# EAGLE schematic CircularControllerBase (EAGLE 8.0.0)
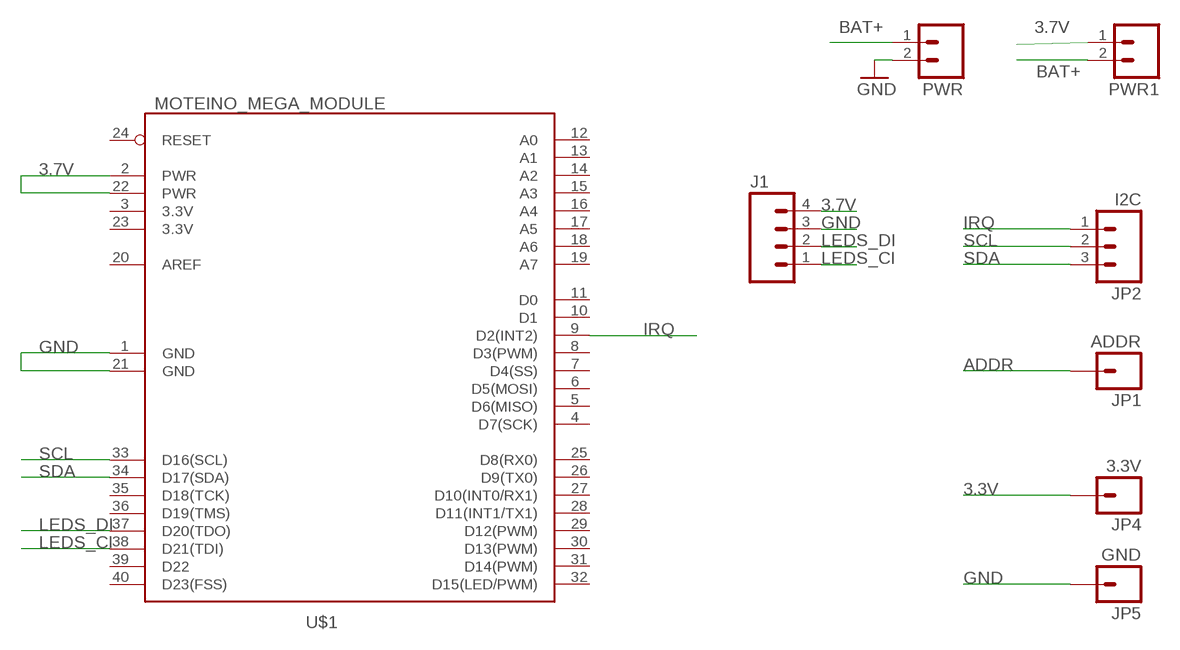
[diagram p0: schematic, sheet 1]

## Parts
J1  M04PTH  [1X04]
JP1  ADDR  M01PTH  [1X01]
JP2  I2C  M03PTH  [1X03]
JP4  3.3V  M01PTH  [1X01]
JP5  GND  M01PTH  [1X01]
PWR  M025MM  [SCREWTERMINAL-5MM-2]
PWR1  M025MM  [SCREWTERMINAL-5MM-2]
U$1  MOTEINO_MEGA_MODULE  [MEGA_SQ]

## Nets
3.3V: JP4.1
3.7V: J1.4 PWR1.1 U$1.2(PWR) U$1.22(PWR)
ADDR: JP1.1
BAT+: PWR1.2 PWR.1
GND: J1.3 JP5.1 PWR.2 U$1.1(GND) U$1.21(GND)
IRQ: JP2.1 U$1.9(D2(INT2))
LEDS_CI: J1.1 U$1.38(D21(TDI))
LEDS_DI: J1.2 U$1.37(D20(TDO))
SCL: JP2.2 U$1.33(D16(SCL))
SDA: JP2.3 U$1.34(D17(SDA))
Unconnected: U$1.4(D7(SCK)) U$1.5(D6(MISO)) U$1.6(D5(MOSI)) U$1.7(D4(SS)) U$1.8(D3(PWM)) U$1.10(D1) U$1.11(D0) U$1.12(A0) U$1.13(A1) U$1.14(A2) U$1.15(A3) U$1.16(A4) U$1.17(A5) U$1.18(A6) U$1.19(A7) U$1.20(AREF) U$1.24(RESET) U$1.25(D8(RX0)) U$1.26(D9(TX0)) U$1.27(D10(INT0/RX1)) U$1.28(D11(INT1/TX1)) U$1.29(D12(PWM)) U$1.30(D13(PWM)) U$1.31(D14(PWM)) U$1.32(D15(LED/PWM)) U$1.35(D18(TCK)) U$1.36(D19(TMS)) U$1.39(D22) U$1.40(D23(FSS))

## Power pins joined to a net without a drawn wire
3.3V: U$1.3(3.3V) U$1.23(3.3V)

## Library data of the parts
J1 = SparkFun-Connectors:M04: Header 4 Standard 4-pin 0.1" header. Use with straight break away headers (SKU : PRT-00116), right angle break away headers (PRT-00553), swiss pins (PRT-00743), machine pins (PRT-00117), and female headers (PRT-00115). Molex polarized connector foot print use with SKU : PRT-08231 with associated crimp pins and housings. 1MM SMD Version SKU: PRT-10208; PROD_ID: CONN-09696
JP1 JP4 JP5 = SparkFun:M01: Header 1 Standard 1-pin 0.1" header. Use with straight break away headers (SKU : PRT-00116), right angle break away headers (PRT-00553), swiss pins (PRT-00743), machine pins (PRT-00117), and female headers (PRT-00115).
JP2 = SparkFun:M03: Header 3 Standard 3-pin 0.1" header. Use with straight break away headers (SKU : PRT-00116), right angle break away headers (PRT-00553), swiss pins (PRT-00743), machine pins (PRT-00117), and female headers (PRT-00115). Molex polarized connector foot print use with SKU : PRT-08232 with associated crimp pins and housings.
PWR PWR1 = SparkFun-Connectors:M02: Standard 2-pin 0.1" header. Use with - straight break away headers ( PRT-00116) - right angle break away headers (PRT-00553) - swiss pins (PRT-00743) - machine pins (PRT-00117) - female headers (PRT-00115) Molex polarized connector foot print use with: PRT-08233 with associated crimp pins and housings. 2.54_SCREWTERM for use with PRT-10571. 3.5mm Screw Terminal footprints for PRT-08084 5mm Screw Terminal footprints for use with PRT-08432; STOREFRONT_ID: PRT-08432
U$1 = MoteinoR4Mod:MOTEINO_MEGA_MODULE

## Net classes
0 default: width 0.203 mm